# Altium schematic sheet Main.SchDoc
size A1; SheetNumber: 1; SheetTotal: 1
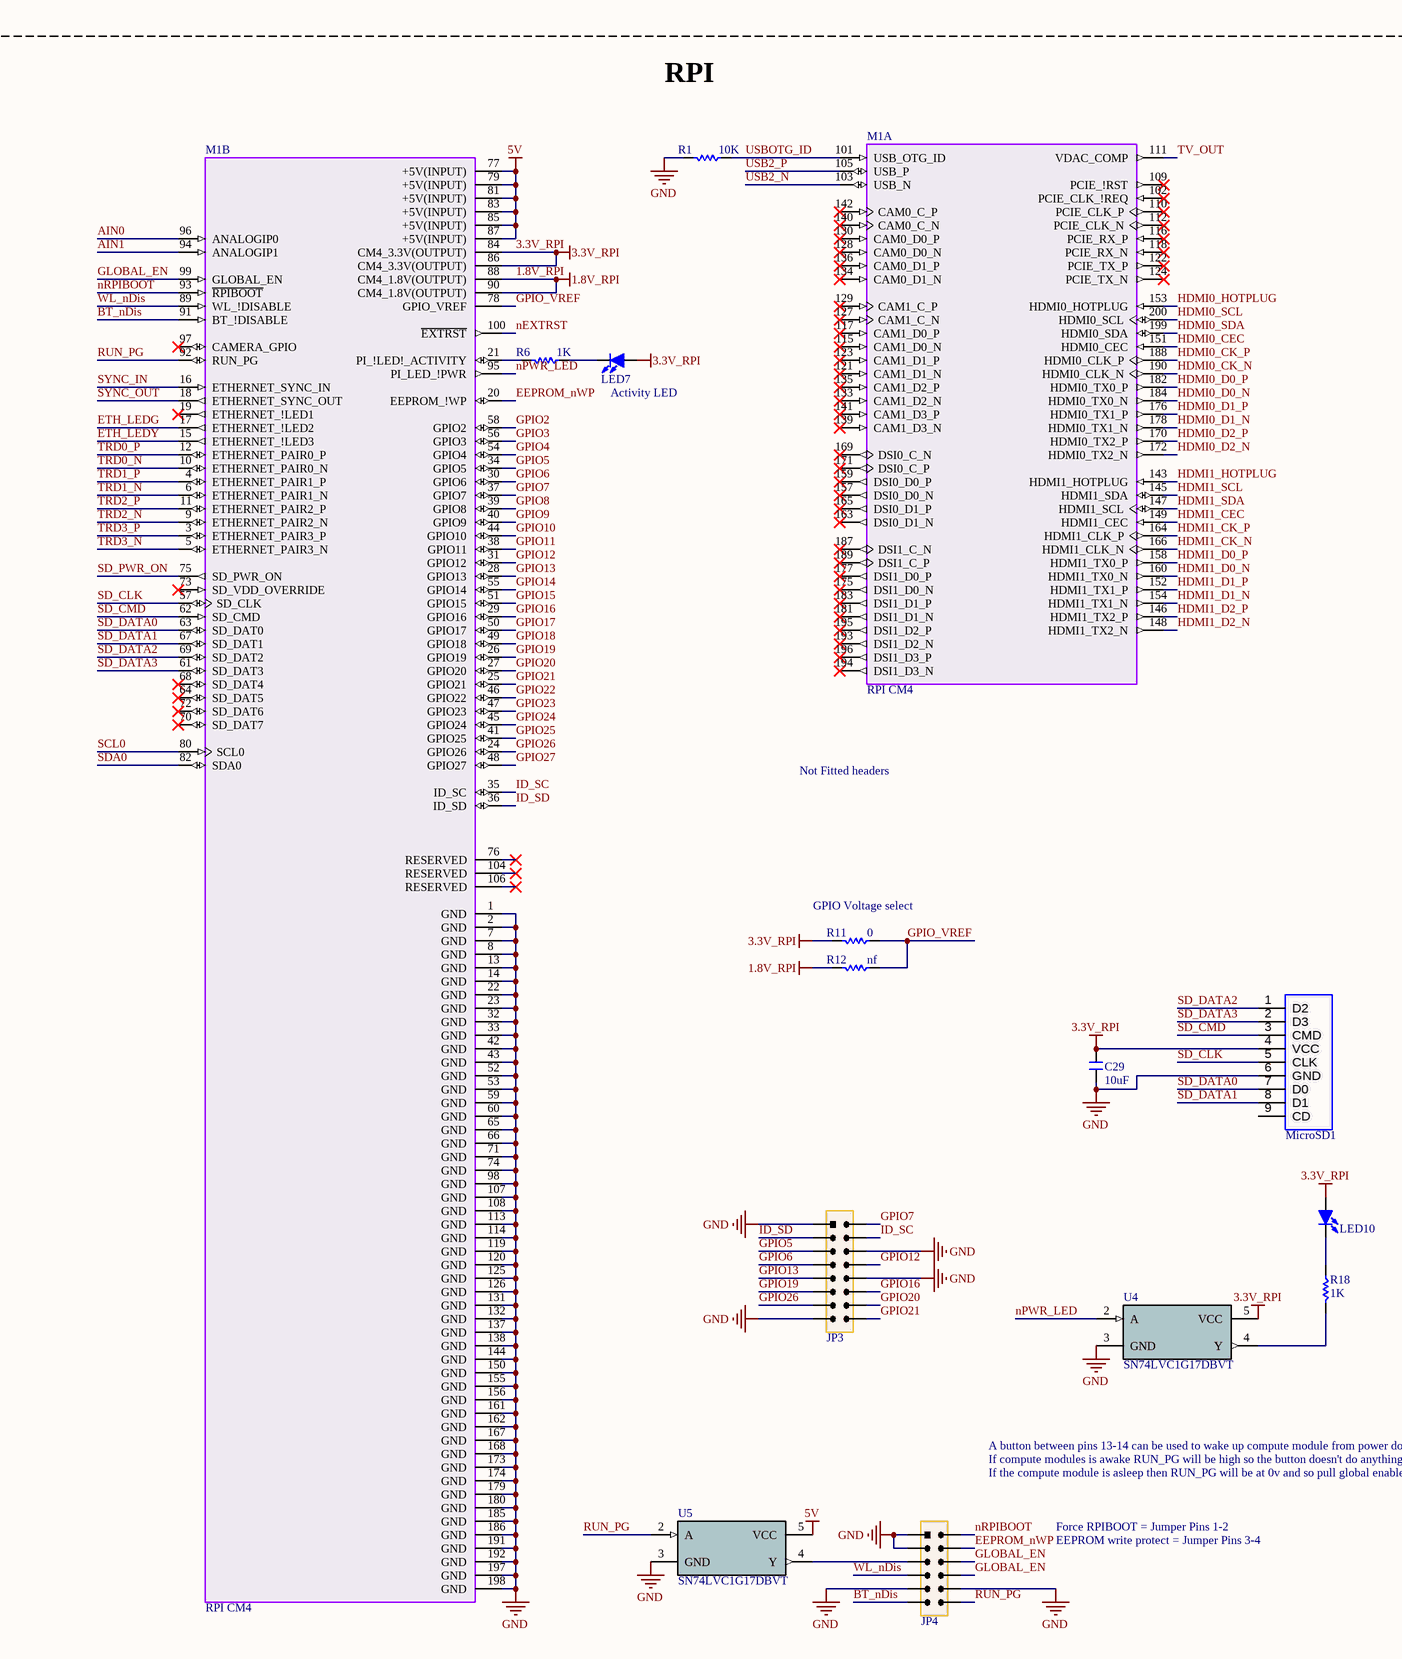
[diagram p0: Main.SchDoc, top left]
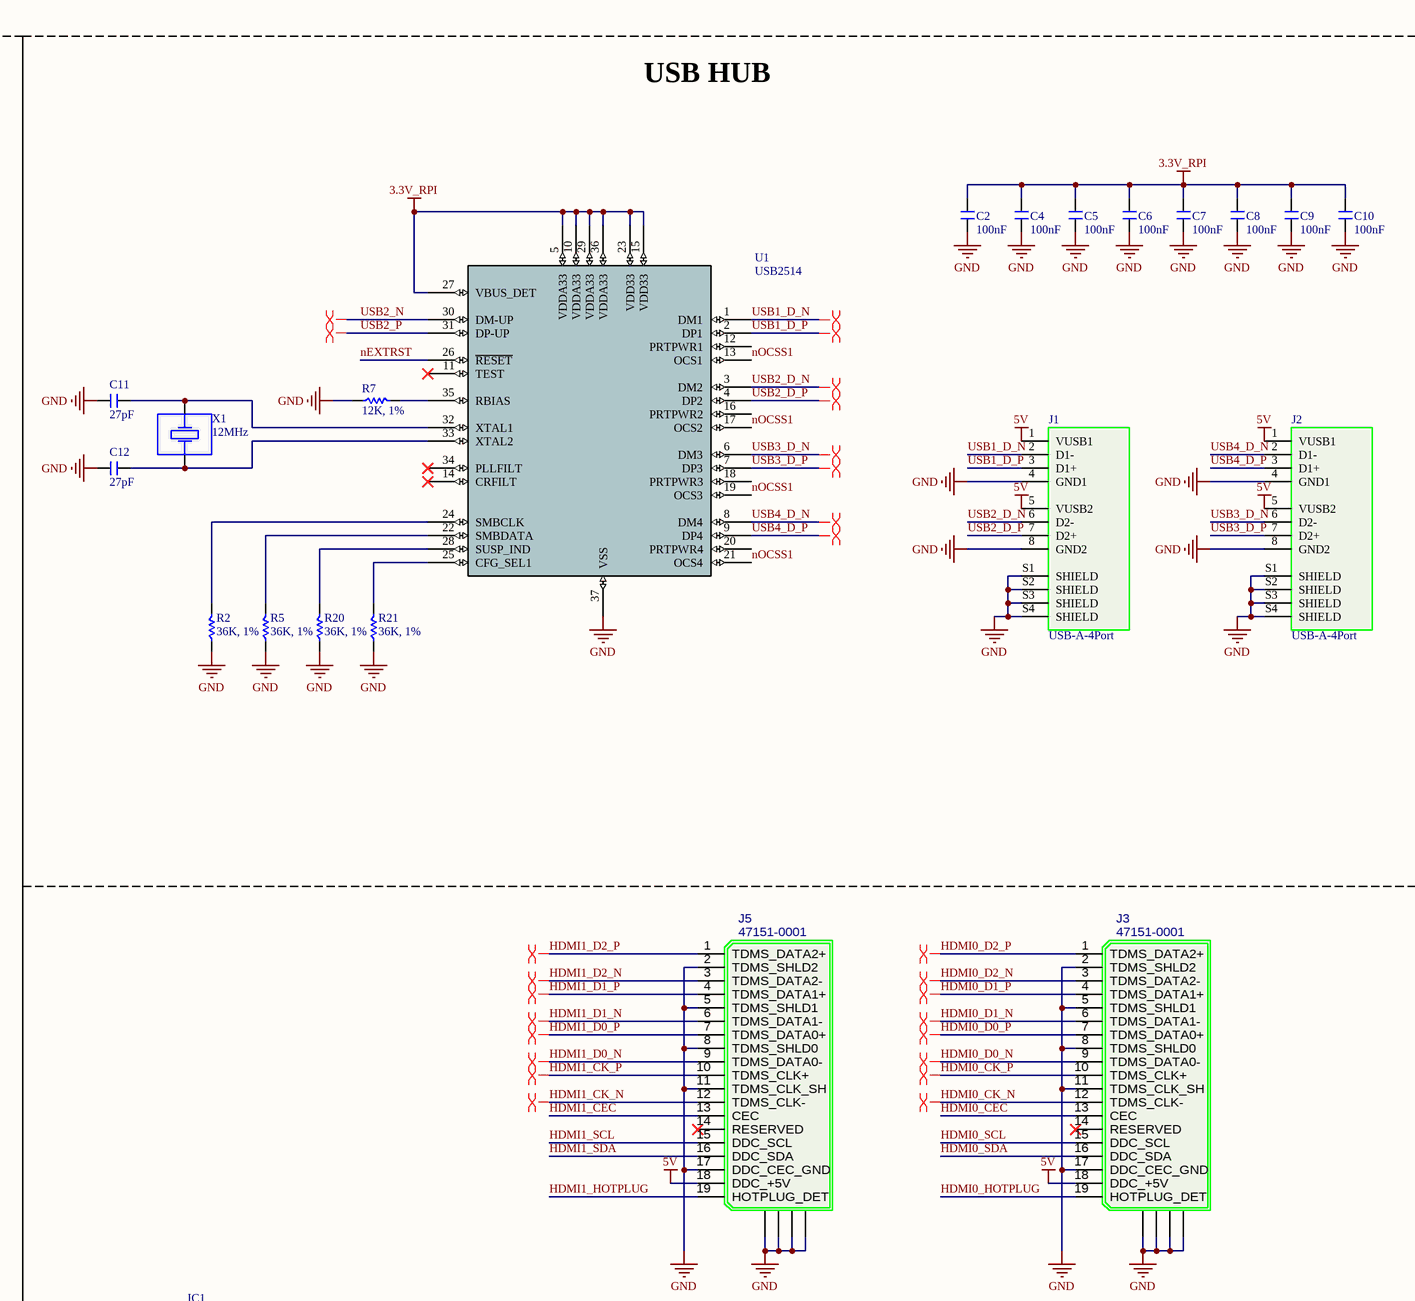
[diagram p1: Main.SchDoc, top middle]
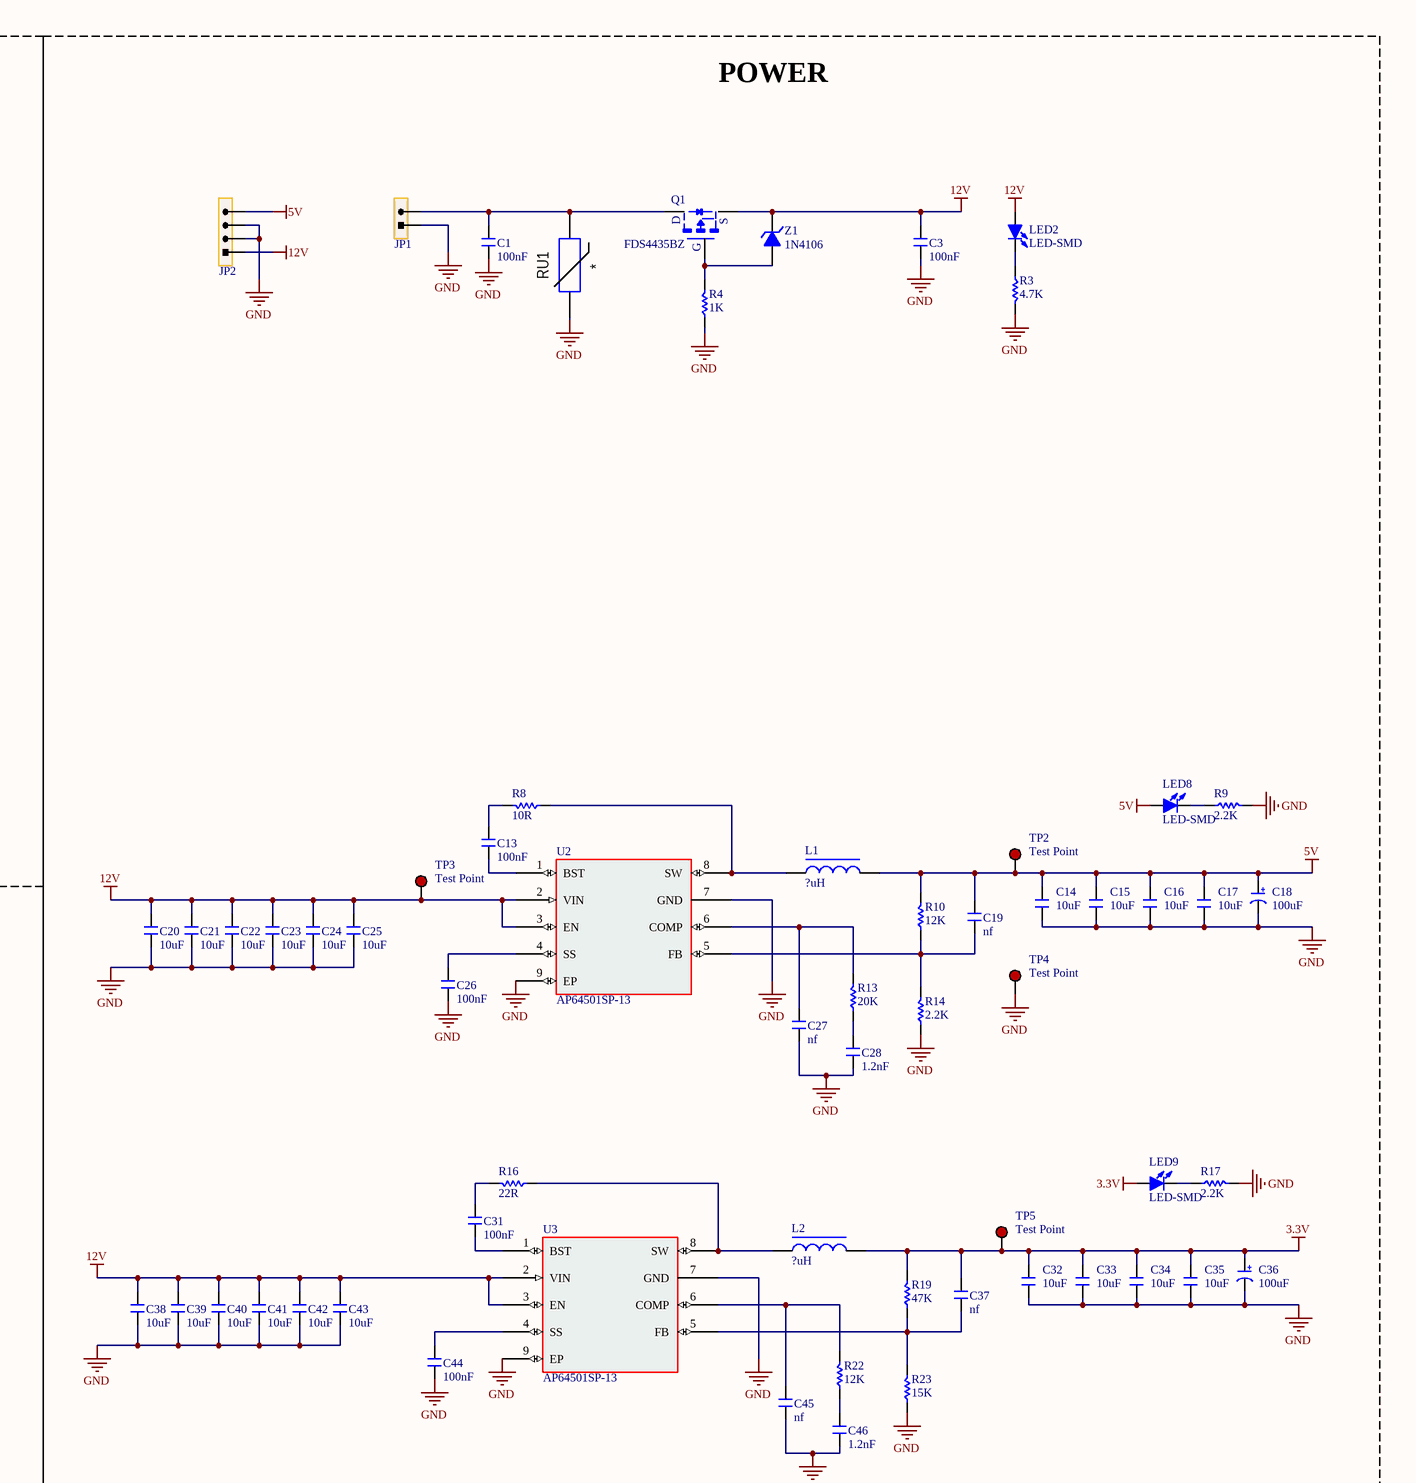
[diagram p2: Main.SchDoc, top right]
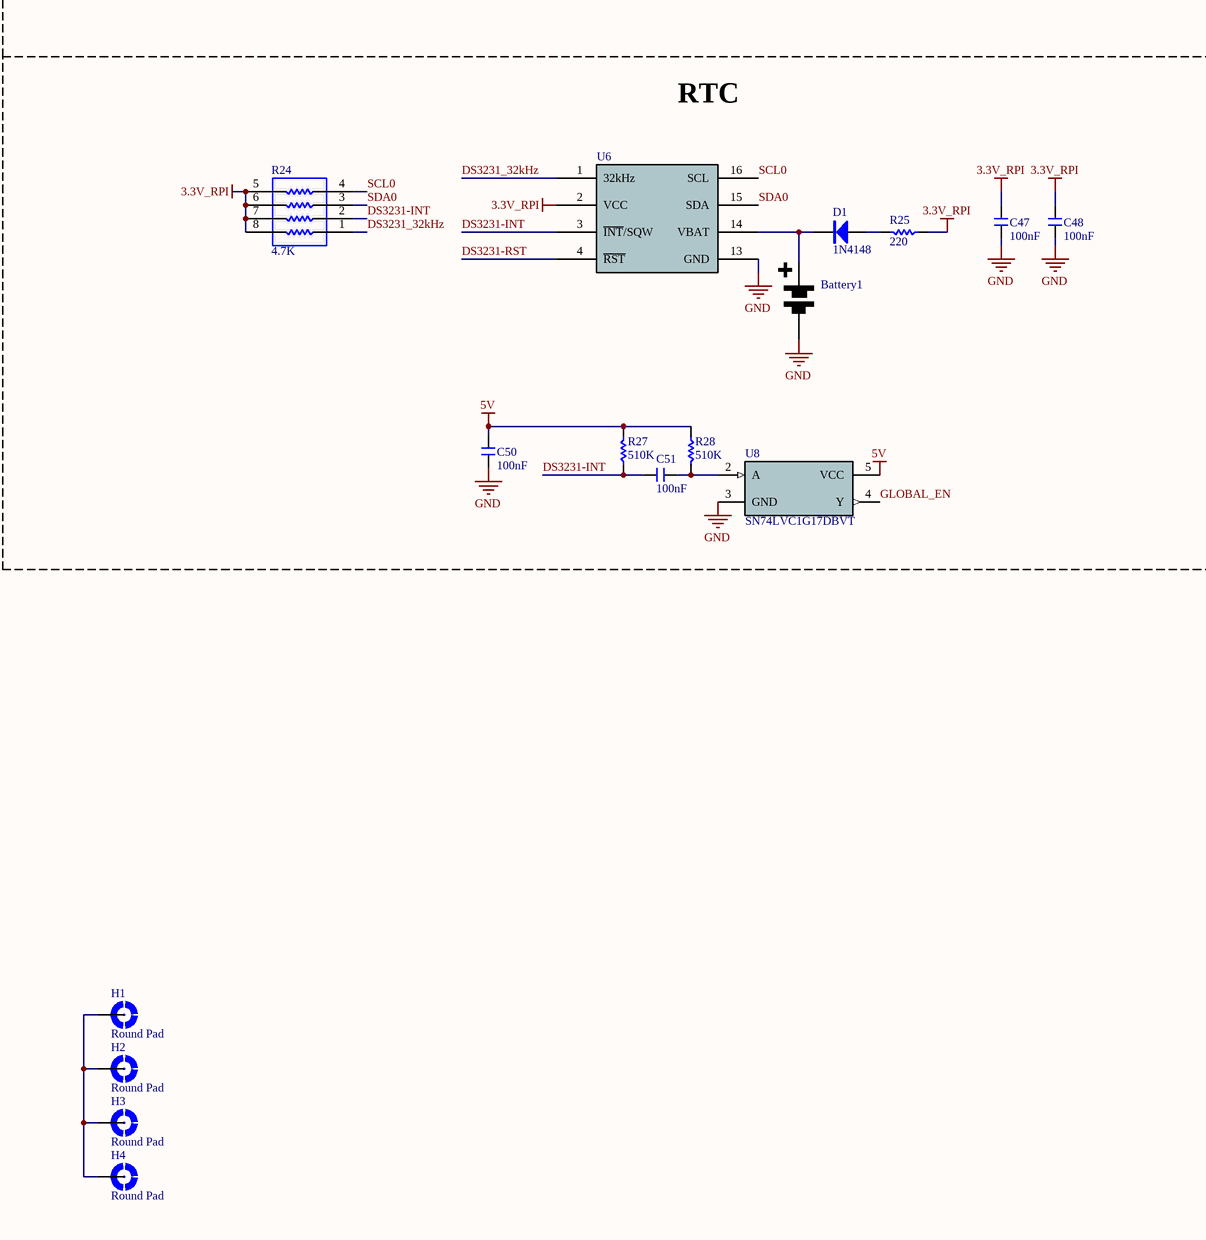
[diagram p3: Main.SchDoc, bottom left]
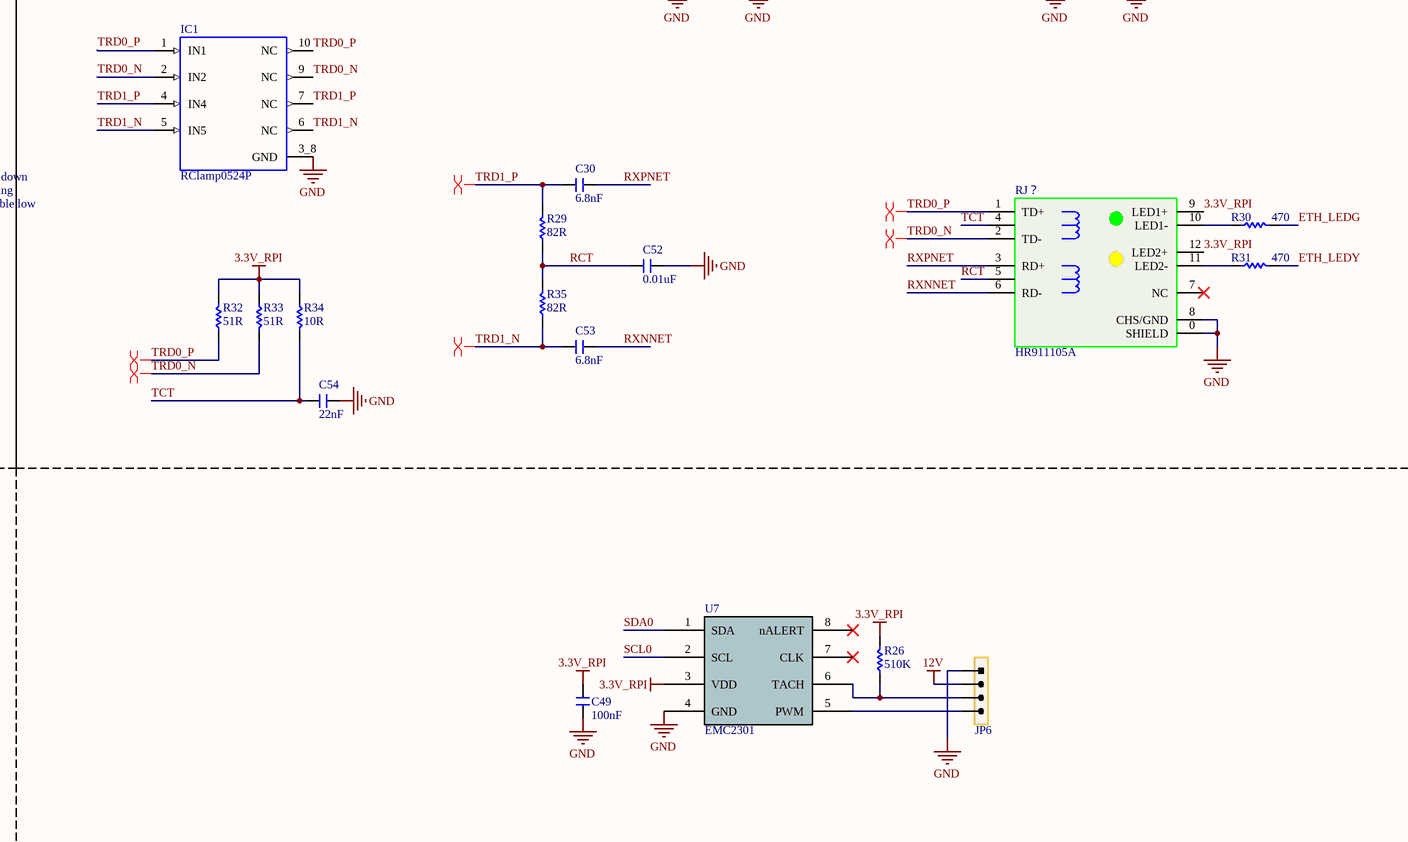
[diagram p4: Main.SchDoc, bottom middle]

## Parts
Battery1  Battery Button Cell  [CR2032]  (value not drawn)
C1  100nF  [C 0805]
C2  100nF  [C 0805]
C3  100nF  [C 0805]
C4  100nF  [C 0805]
C5  100nF  [C 0805]
C6  100nF  [C 0805]
C7  100nF  [C 0805]
C8  100nF  [C 0805]
C9  100nF  [C 0805]
C10  100nF  [C 0805]
C11  27pF  [C 0805]
C12  27pF  [C 0805]
C13  100nF  [C 0805]
C14  10uF  [C 0805]
C15  10uF  [C 0805]
C16  10uF  [C 0805]
C17  10uF  [C 0805]
C18  100uF  [CD D(7343)]
C19  nf  [C 0805]
C20  10uF  [C 0805]
C21  10uF  [C 0805]
C22  10uF  [C 0805]
C23  10uF  [C 0805]
C24  10uF  [C 0805]
C25  10uF  [C 0805]
C26  100nF  [C 0805]
C27  nf  [C 0805]
C28  1.2nF  [C 0805]
C29  10uF  [C 0805]
C30  6.8nF  [C 0805]
C31  100nF  [C 0805]
C32  10uF  [C 0805]
C33  10uF  [C 0805]
C34  10uF  [C 0805]
C35  10uF  [C 0805]
C36  100uF  [CD D(7343)]
C37  nf  [C 0805]
C38  10uF  [C 0805]
C39  10uF  [C 0805]
C40  10uF  [C 0805]
C41  10uF  [C 0805]
C42  10uF  [C 0805]
C43  10uF  [C 0805]
C44  100nF  [C 0805]
C45  nf  [C 0805]
C46  1.2nF  [C 0805]
C47  100nF  [C 0805]
C48  100nF  [C 0805]
C49  100nF  [C 0805]
C50  100nF  [C 0805]
C51  100nF  [C 0805]
C52  0.01uF  [C 0805]
C53  6.8nF  [C 0805]
C54  22nF  [C 0805]
D1  1N4148  [MINI_MELF (LL34)]
H1  Round Pad  [P3.2C]  (no BOM)
H2  Round Pad  [P3.2C]  (no BOM)
H3  Round Pad  [P3.2C]  (no BOM)
H4  Round Pad  [P3.2C]  (no BOM)
IC1  RClamp0524P  [RClamp0524P]
J1  USB-A-4Port  [USB-A-4Port]
J2  USB-A-4Port  [USB-A-4Port]
J3  47151-0001  [HDMI-A]
J5  47151-0001  [HDMI-A]
JP1  HDR-1X2  [KF2EDGK-2P_H_5.08]  (value not drawn)
JP2  HDR-1X4  [KF2EDGK-4P_H_5.08]  (value not drawn)
JP3  Header 8X2  [HDR-8X2]  (value not drawn)
JP4  Header 6X2  [HDR-6X2]  (value not drawn)
JP6  HDR-1X4  [KF2EDGK-4P_H_5.08]  (value not drawn)
L1  ?uH  [CD53]
L2  ?uH  [CD53]
LED2  LED-SMD  [LED 0805R]
LED7  LED GREEN  [LED 0805R]  (value not drawn)
LED8  LED-SMD  [LED 0805R]
LED9  LED-SMD  [LED 0805R]
LED10  LED RED  [LED 0805R]  (value not drawn)
M1  RPI CM4  [CM4]  (parts A,B of 2)
MicroSD1  MicroSD Card  [micro SD Card]  (value not drawn)
Q1  FDS4435BZ  [SOP8-E3]
R1  10K  [R 0805]
R2  36K, 1%  [R 0805]
R3  4.7K  [R 0805]
R4  1K  [R 0805]
R5  36K, 1%  [R 0805]
R6  1K  [R 0805]
R7  12K, 1%  [R 0805]
R8  10R  [R 0805]
R9  2.2K  [R 0805]
R10  12K  [R 0805]
R11  0  [R 0805]
R12  nf  [R 0805]
R13  20K  [R 0805]
R14  2.2K  [R 0805]
R16  22R  [R 0805]
R17  2.2K  [R 0805]
R18  1K  [R 0805]
R19  47K  [R 0805]
R20  36K, 1%  [R 0805]
R21  36K, 1%  [R 0805]
R22  12K  [R 0805]
R23  15K  [R 0805]
R24  4.7K  [RA1206 (4x0603)]
R25  220  [R 0805]
R26  510K  [R 0805]
R27  510K  [R 0805]
R28  510K  [R 0805]
R29  82R  [R 0805]
R30  470  [R 0805]
R31  470  [R 0805]
R32  51R  [R 0805]
R33  51R  [R 0805]
R34  10R  [R 0805]
R35  82R  [R 0805]
RJ？  HR911105A  [RJ-45A12]
RU1  *  [SMA]
TP2  Test Point  [TEST_POINT_40MIL_R]
TP3  Test Point  [TEST_POINT_40MIL_R]
TP4  Test Point  [TEST_POINT_40MIL_R]
TP5  Test Point  [TEST_POINT_40MIL_R]
U1  USB2514  [QFN36]
U2  AP64501SP-13  [SOP8_M-EP]
U3  AP64501SP-13  [SOP8_M-EP]
U4  SN74LVC1G17DBVT  [SOT23-5M]
U5  SN74LVC1G17DBVT  [SOT23-5M]
U6  DS3231  [SOP16W_L]  (value not drawn)
U7  EMC2301  [MSOP-8]
U8  SN74LVC1G17DBVT  [SOT23-5M]
X1  12MHz  [XTAL-HC49S-SMD]
Z1  1N4106  [DO-213AA]

## Nets
1.8V_RPI: M1.88(CM4_1.8V(OUTPUT)) M1.90(CM4_1.8V(OUTPUT)) R12.2
3.3V: C32.1 C33.1 C34.1 C35.1 C36.1(A) C37.1 L2.2 LED9.1(A) R19.2 TP5.1
3.3V_RPI: C2.1 C4.1 C5.1 C6.1 C7.1 C8.1 C9.1 C10.1 C29.1 C47.1 C48.2 C49.1 LED7.1(A) LED10.1(A) M1.84(CM4_3.3V(OUTPUT)) M1.86(CM4_3.3V(OUTPUT)) MicroSD1.4(VCC) R11.2 R24.5 R24.6 R24.7 R24.8 R25.1 R26.2 R32.2 R33.1 R34.1 RJ？.9(LED1+) RJ？.12(LED2+) U1.5(VDDA33) U1.10(VDDA33) U1.15(VDD33) U1.23(VDD33) U1.27(VBUS_DET) U1.29(VDDA33) U1.36(VDDA33) U4.5(VCC) U6.2(VCC) U7.3(VDD)
5V: C14.1 C15.1 C16.1 C17.1 C18.1(A) C19.1 C50.1 J1.1(VUSB1) J1.5(VUSB2) J2.1(VUSB1) J2.5(VUSB2) J3.18(DDC_+5V) J5.18(DDC_+5V) JP2.4 L1.2 LED8.1(A) M1.77(+5V(INPUT)) M1.79(+5V(INPUT)) M1.81(+5V(INPUT)) M1.83(+5V(INPUT)) M1.85(+5V(INPUT)) M1.87(+5V(INPUT)) R10.2 R27.2 R28.1 TP2.1 U5.5(VCC) U8.5(VCC)
12V: C3.1 C20.1 C21.1 C22.1 C23.1 C24.1 C25.1 C38.1 C39.1 C40.1 C41.1 C42.1 C43.1 JP2.1 JP6.2 LED2.1(A) Q1.1-3(S) TP3.1 U2.2(VIN) U2.3(EN) U3.2(VIN) U3.3(EN) Z1.2(K)
GND: Battery1.2(-) C1.2 C2.2 C3.2 C4.2 C5.2 C6.2 C7.2 C8.2 C9.2 C10.2 C11.2 C12.2 C14.2 C15.2 C16.2 C17.2 C18.2(K) C20.2 C21.2 C22.2 C23.2 C24.2 C25.2 C26.2 C27.2 C28.2 C29.2 C32.2 C33.2 C34.2 C35.2 C36.2(K) C38.2 C39.2 C40.2 C41.2 C42.2 C43.2 C44.2 C45.2 C46.2 C47.2 C48.1 C49.2 C50.2 C52.2 C54.2 IC1.3_8(GND) J1.4(GND1) J1.8(GND2) J1.S1(SHIELD) J1.S2(SHIELD) J1.S3(SHIELD) J1.S4(SHIELD) J2.4(GND1) J2.8(GND2) J2.S1(SHIELD) J2.S2(SHIELD) J2.S3(SHIELD) J2.S4(SHIELD) J3.2(TDMS_SHLD2) J3.5(TDMS_SHLD1) J3.8(TDMS_SHLD0) J3.11(TDMS_CLK_SH) J3.17(DDC_CEC_GND) J3.20(SHIELD) J3.21(SHIELD) J3.22(SHIELD) J3.23(SHIELD) J5.2(TDMS_SHLD2) J5.5(TDMS_SHLD1) J5.8(TDMS_SHLD0) J5.11(TDMS_CLK_SH) J5.17(DDC_CEC_GND) J5.20(SHIELD) J5.21(SHIELD) J5.22(SHIELD) J5.23(SHIELD) JP1.1 JP2.2 JP2.3 JP3.1 JP3.6 JP3.10 JP3.15 JP4.1 JP4.3 JP4.9 JP4.10 JP6.1 M1.1(GND) M1.2(GND) M1.7(GND) M1.8(GND) M1.13(GND) M1.14(GND) M1.22(GND) M1.23(GND) M1.32(GND) M1.33(GND) M1.42(GND) M1.43(GND) M1.52(GND) M1.53(GND) M1.59(GND) M1.60(GND) M1.65(GND) M1.66(GND) M1.71(GND) M1.74(GND) M1.98(GND) M1.107(GND) M1.108(GND) M1.113(GND) M1.114(GND) M1.119(GND) M1.120(GND) M1.125(GND) M1.126(GND) M1.131(GND) M1.132(GND) M1.137(GND) M1.138(GND) M1.144(GND) M1.150(GND) M1.155(GND) M1.156(GND) M1.161(GND) M1.162(GND) M1.167(GND) M1.168(GND) M1.173(GND) M1.174(GND) M1.179(GND) M1.180(GND) M1.185(GND) M1.186(GND) M1.191(GND) M1.192(GND) M1.197(GND) M1.198(GND) MicroSD1.6(GND) R1.2 R2.1 R3.2 R4.1 R5.1 R7.1 R9.2 R14.1 R17.2 R20.1 R21.1 R23.1 RJ？.0(SHIELD) RJ？.8(CHS/GND) RU1.1 TP4.1 U1.37(VSS) U2.7(GND) U2.9(EP) U3.7(GND) U3.9(EP) U4.3(GND) U5.3(GND) U6.13(GND) U7.4(GND) U8.3(GND)
SHIELD: H1.P H2.P H3.P H4.P
AIN0: M1.96(ANALOGIP0)
AIN1: M1.94(ANALOGIP1)
BT_nDis: JP4.11 M1.91(BT_!DISABLE)
DS3231-INT: C51.2 R24.2 R27.1 U6.3(~{INT}/SQW)
DS3231-RST: U6.4(~{RST})
DS3231_32kHz: R24.1 U6.1(32kHz)
EEPROM_nWP: JP4.4 M1.20(EEPROM_!WP)
ETH_LEDG: M1.17(ETHERNET_!LED2) R30.2
ETH_LEDY: M1.15(ETHERNET_!LED3) R31.2
GLOBAL_EN: JP4.6 JP4.8 M1.99(GLOBAL_EN) U8.4(Y)
GPIO2: M1.58(GPIO2)
GPIO3: M1.56(GPIO3)
GPIO4: M1.54(GPIO4)
GPIO5: JP3.5 M1.34(GPIO5)
GPIO6: JP3.7 M1.30(GPIO6)
GPIO7: JP3.2 M1.37(GPIO7)
GPIO8: M1.39(GPIO8)
GPIO9: M1.40(GPIO9)
GPIO10: M1.44(GPIO10)
GPIO11: M1.38(GPIO11)
GPIO12: JP3.8 M1.31(GPIO12)
GPIO13: JP3.9 M1.28(GPIO13)
GPIO14: M1.55(GPIO14)
GPIO15: M1.51(GPIO15)
GPIO16: JP3.12 M1.29(GPIO16)
GPIO17: M1.50(GPIO17)
GPIO18: M1.49(GPIO18)
GPIO19: JP3.11 M1.26(GPIO19)
GPIO20: JP3.14 M1.27(GPIO20)
GPIO21: JP3.16 M1.25(GPIO21)
GPIO22: M1.46(GPIO22)
GPIO23: M1.47(GPIO23)
GPIO24: M1.45(GPIO24)
GPIO25: M1.41(GPIO25)
GPIO26: JP3.13 M1.24(GPIO26)
GPIO27: M1.48(GPIO27)
GPIO_VREF: M1.78(GPIO_VREF) R11.1 R12.1
HDMI0_CEC: J3.13(CEC) M1.151(HDMI0_CEC)
HDMI0_CK_N: J3.12(TDMS_CLK-) M1.190(HDMI0_CLK_N)
HDMI0_CK_P: J3.10(TDMS_CLK+) M1.188(HDMI0_CLK_P)
HDMI0_D0_N: J3.9(TDMS_DATA0-) M1.184(HDMI0_TX0_N)
HDMI0_D0_P: J3.7(TDMS_DATA0+) M1.182(HDMI0_TX0_P)
HDMI0_D1_N: J3.6(TDMS_DATA1-) M1.178(HDMI0_TX1_N)
HDMI0_D1_P: J3.4(TDMS_DATA1+) M1.176(HDMI0_TX1_P)
HDMI0_D2_N: J3.3(TDMS_DATA2-) M1.172(HDMI0_TX2_N)
HDMI0_D2_P: J3.1(TDMS_DATA2+) M1.170(HDMI0_TX2_P)
HDMI0_HOTPLUG: J3.19(HOTPLUG_DET) M1.153(HDMI0_HOTPLUG)
HDMI0_SCL: J3.15(DDC_SCL) M1.200(HDMI0_SCL)
HDMI0_SDA: J3.16(DDC_SDA) M1.199(HDMI0_SDA)
HDMI1_CEC: J5.13(CEC) M1.149(HDMI1_CEC)
HDMI1_CK_N: J5.12(TDMS_CLK-) M1.166(HDMI1_CLK_N)
HDMI1_CK_P: J5.10(TDMS_CLK+) M1.164(HDMI1_CLK_P)
HDMI1_D0_N: J5.9(TDMS_DATA0-) M1.160(HDMI1_TX0_N)
HDMI1_D0_P: J5.7(TDMS_DATA0+) M1.158(HDMI1_TX0_P)
HDMI1_D1_N: J5.6(TDMS_DATA1-) M1.154(HDMI1_TX1_N)
HDMI1_D1_P: J5.4(TDMS_DATA1+) M1.152(HDMI1_TX1_P)
HDMI1_D2_N: J5.3(TDMS_DATA2-) M1.148(HDMI1_TX2_N)
HDMI1_D2_P: J5.1(TDMS_DATA2+) M1.146(HDMI1_TX2_P)
HDMI1_HOTPLUG: J5.19(HOTPLUG_DET) M1.143(HDMI1_HOTPLUG)
HDMI1_SCL: J5.15(DDC_SCL) M1.145(HDMI1_SDA)
HDMI1_SDA: J5.16(DDC_SDA) M1.147(HDMI1_SCL)
ID_SC: JP3.4 M1.35(ID_SC)
ID_SD: JP3.3 M1.36(ID_SD)
nEXTRST: M1.100(~{EXTRST}) U1.26(~{RESET})
nOCSS1: U1.13(OCS1) U1.17(OCS2) U1.19(OCS3) U1.21(OCS4)
nPWR_LED: M1.95(PI_LED_!PWR) U4.2(A)
nRPIBOOT: JP4.2 M1.93(~{RPIBOOT})
RCT: C52.1 R29.1 R35.2 RJ？.5
RUN_PG: JP4.12 M1.92(RUN_PG) U5.2(A)
RXNNET: C53.2 RJ？.6(RD-)
RXPNET: C30.2 RJ？.3(RD+)
SCL0: M1.80(SCL0) R24.4 U6.16(SCL) U7.2(SCL)
SD_CLK: M1.57(SD_CLK) MicroSD1.5(CLK)
SD_CMD: M1.62(SD_CMD) MicroSD1.3(CMD)
SD_DATA0: M1.63(SD_DAT0) MicroSD1.7(D0)
SD_DATA1: M1.67(SD_DAT1) MicroSD1.8(D1)
SD_DATA2: M1.69(SD_DAT2) MicroSD1.1(D2)
SD_DATA3: M1.61(SD_DAT3) MicroSD1.2(D3)
SD_PWR_ON: M1.75(SD_PWR_ON)
SDA0: M1.82(SDA0) R24.3 U6.15(SDA) U7.1(SDA)
SYNC_IN: M1.16(ETHERNET_SYNC_IN)
SYNC_OUT: M1.18(ETHERNET_SYNC_OUT)
TCT: C54.1 R34.2 RJ？.4
TRD0_N: IC1.2(IN2) IC1.9(NC) M1.10(ETHERNET_PAIR0_N) R33.2 RJ？.2(TD-)
TRD0_P: IC1.1(IN1) IC1.10(NC) M1.12(ETHERNET_PAIR0_P) R32.1 RJ？.1(TD+)
TRD1_N: C53.1 IC1.5(IN5) IC1.6(NC) M1.6(ETHERNET_PAIR1_N) R35.1
TRD1_P: C30.1 IC1.4(IN4) IC1.7(NC) M1.4(ETHERNET_PAIR1_P) R29.2
TRD2_N: M1.9(ETHERNET_PAIR2_N)
TRD2_P: M1.11(ETHERNET_PAIR2_P)
TRD3_N: M1.5(ETHERNET_PAIR3_N)
TRD3_P: M1.3(ETHERNET_PAIR3_P)
TV_OUT: M1.111(VDAC_COMP)
USB1_D_N: J1.2(D1-) U1.1(DM1)
USB1_D_P: J1.3(D1+) U1.2(DP1)
USB2_D_N: J1.6(D2-) U1.3(DM2)
USB2_D_P: J1.7(D2+) U1.4(DP2)
USB2_N: M1.103(USB_N) U1.30(DM-UP)
USB2_P: M1.105(USB_P) U1.31(DP-UP)
USB3_D_N: J2.6(D2-) U1.6(DM3)
USB3_D_P: J2.7(D2+) U1.7(DP3)
USB4_D_N: J2.2(D1-) U1.8(DM4)
USB4_D_P: J2.3(D1+) U1.9(DP4)
USBOTG_ID: M1.101(USB_OTG_ID) R1.1
WL_nDis: JP4.7 M1.89(WL_!DISABLE)
NetBattery1_1: Battery1.1(+) D1.2(K) U6.14(VBAT)
NetC1_1: C1.1 JP1.2 Q1.5-8(D) RU1.2
NetC11_1: C11.1 U1.32(XTAL1) X1.2
NetC12_1: C12.1 U1.33(XTAL2) X1.1
NetC13_1: C13.1 U2.1(BST)
NetC13_2: C13.2 R8.2
NetC19_2: C19.2 R10.1 R14.2 U2.5(FB)
NetC26_1: C26.1 U2.4(SS)
NetC27_1: C27.1 R13.2 U2.6(COMP)
NetC28_1: C28.1 R13.1
NetC31_1: C31.1 U3.1(BST)
NetC31_2: C31.2 R16.2
NetC37_2: C37.2 R19.1 R23.2 U3.5(FB)
NetC44_1: C44.1 U3.4(SS)
NetC45_1: C45.1 R22.2 U3.6(COMP)
NetC46_1: C46.1 R22.1
NetC51_1: C51.1 R28.2 U8.2(A)
NetD1_1: D1.1(A) R25.2
NetH1_P: H1.P H2.P H3.P H4.P
NetJP4_5: JP4.5 U5.4(Y)
NetJP6_3: JP6.3 R26.1 U7.6(TACH)
NetJP6_4: JP6.4 U7.5(PWM)
NetL1_1: L1.1 R8.1 U2.8(SW)
NetL2_1: L2.1 R16.1 U3.8(SW)
NetLED2_2: LED2.2(K) R3.1
NetLED7_2: LED7.2(K) R6.1
NetLED8_2: LED8.2(K) R9.1
NetLED9_2: LED9.2(K) R17.1
NetLED10_2: LED10.2(K) R18.1
NetM1_21: M1.21(PI_!LED!_ACTIVITY) R6.2
NetQ1_4: Q1.4(G) R4.2 Z1.1(A)
NetR2_2: R2.2 U1.24(SMBCLK)
NetR5_2: R5.2 U1.22(SMBDATA)
NetR7_2: R7.2 U1.35(RBIAS)
NetR18_2: R18.2 U4.4(Y)
NetR20_2: R20.2 U1.28(SUSP_IND)
NetR21_2: R21.2 U1.25(CFG_SEL1)
NetR30_1: R30.1 RJ？.10(LED1-)
NetR31_1: R31.1 RJ？.11(LED2-)

Not connected (* = marked no-connect by the designer): J3 14(RESERVED)*; J5 14(RESERVED)*; M1 19(ETHERNET_!LED1)* 64(SD_DAT5)* 68(SD_DAT4)* 70(SD_DAT7)* 72(SD_DAT6)* 73(SD_VDD_OVERRIDE)* 76(RESERVED)* 97(CAMERA_GPIO)* 102(PCIE_CLK_!REQ)* 104(RESERVED)* 106(RESERVED)* 109(PCIE_!RST)* 110(PCIE_CLK_P)* 112(PCIE_CLK_N)* 115(CAM1_D0_N)* 116(PCIE_RX_P)* 117(CAM1_D0_P)* 118(PCIE_RX_N)* 121(CAM1_D1_N)* 122(PCIE_TX_P)* 123(CAM1_D1_P)* 124(PCIE_TX_N)* 127(CAM1_C_N)* 128(CAM0_D0_N)* 129(CAM1_C_P)* 130(CAM0_D0_P)* 133(CAM1_D2_N)* 134(CAM0_D1_N)* 135(CAM1_D2_P)* 136(CAM0_D1_P)* 139(CAM1_D3_N)* 140(CAM0_C_N)* 141(CAM1_D3_P)* 142(CAM0_C_P)* 157(DSI0_D0_N)* 159(DSI0_D0_P)* 163(DSI0_D1_N)* 165(DSI0_D1_P)* 169(DSI0_C_N)* 171(DSI0_C_P)* 175(DSI1_D0_N)* 177(DSI1_D0_P)* 181(DSI1_D1_N)* 183(DSI1_D1_P)* 187(DSI1_C_N)* 189(DSI1_C_P)* 193(DSI1_D2_N)* 194(DSI1_D3_N)* 195(DSI1_D2_P)* 196(DSI1_D3_P)*; MicroSD1 9(CD); RJ？ 7(NC)*; U1 11(TEST)* 12(PRTPWR1) 14(CRFILT)* 16(PRTPWR2) 18(PRTPWR3) 20(PRTPWR4) 34(PLLFILT)*; U7 7(CLK)* 8(nALERT)*

## Layout directives
differential pair: HDMI0_CK_N, HDMI0_CK_P, HDMI0_D0_N, HDMI0_D0_P, HDMI0_D1_N, HDMI0_D1_P, HDMI0_D2_N, HDMI0_D2_P, HDMI1_CK_N, HDMI1_CK_P, HDMI1_D0_N, HDMI1_D0_P, HDMI1_D1_N, HDMI1_D1_P, HDMI1_D2_N, HDMI1_D2_P, TRD0_N, TRD0_P, TRD1_N, TRD1_P, USB1_D_N, USB1_D_P, USB2_D_N, USB2_D_P, USB2_N, USB2_P, USB3_D_N, USB3_D_P, USB4_D_N, USB4_D_P

## Notes on the sheet
- RPI
- USB HUB
- POWER
- (near LED7) Activity LED
- Not Fitted headers
- (near R11) GPIO Voltage select
- A button between pins 13-14 can be used to wake up compute module from power down
- If compute modules is awake RUN_PG will be high so the button doesn't do anything
- If the compute module is asleep then RUN_PG will be at 0v and so pull global enable low
- Force RPIBOOT = Jumper Pins 1-2
- EEPROM write protect = Jumper Pins 3-4
- RTC
- (in symbol C-CD) +

## Library data of the parts
Battery1 = Battery Button Cell: Mini Battery
C1-C17 C19-C35 C37-C54 = C: Non-polar patch capacitor; BOM名称: 无极性贴片电容; 版权归属: 源创客; 学习资源: www.ooocke.com
C18 C36 = C-CD: Solid Tantalum Chip Capacitor, Standard T491 Series - Industrial Grade; Published: 17-Jul-2002; LatestRevisionDate: 19-Mar-2004; LatestRevisionNote: Silkscreen dimensions re-sized.; DatasheetDocument: Mar-2001; PackageDocument: Mar-2001; PackageReference: B; Publisher: Altium Limited; Code_JEITA: 3528-21; ComponentLink1Description: Manufacturer Link; ComponentLink1URL: http://www.kemet.com/; ComponentLink2Description: Datasheet; ComponentLink2URL: http://www.kemet.com/kemet/web/homepage/kechome.nsf/vapubfilesname/F3102TA.pdf/$file/F3102TA.pdf
D1 = 1N4148: High speed switching diode; BOM名称: 高速开关二极管; 版权归属: 源创客; 学习资源: www.ooocke.com
H1-H4 = MOUNT-PAD-ROUND: MOUNTING PAD, round
J3 J5 = HDMI-A: CONNECTOR, HDMI TYPE A, R/A, SMD; Manufacturer: MOLEX; Part Number: 47151-0001
JP1 = Header 2: 2P Connector; BOM名称: 2P接插件; 版权归属: 源创客; 学习资源: www.ooocke.com
JP2 JP6 = Header 4: 4P Connector; BOM名称: 4P接插件; 版权归属: 源创客; 学习资源: www.ooocke.com
JP3 = Header 8X2: 8*2P Connector; BOM名称: 8*2P接插件; 版权归属: 源创客; 学习资源: www.ooocke.com
JP4 = Header  6X2: 6*2P Connector; BOM名称: 6*2P接插件; 版权归属: 源创客; 学习资源: www.ooocke.com
L1 L2 = L-CD: Chip power inductor; BOM名称: 功率电感; 版权归属: 源创客; 学习资源: www.ooocke.com
LED2 LED7-LED10 = LED-SMD: Patch LED; BOM名称: 贴片LED; 版权归属: 源创客; 学习资源: www.ooocke.com
M1 = CM4
MicroSD1 = MicroSD Card: MicroSD
R1-R14 R16-R23 R25-R35 = R: Chip resistor; 版权归属: 源创客; BOM名称: Chip resistor; 学习资源: www.ooocke.com
R24 = R-ARR: 4 way Chip Resistor Array
RJ？ = HR911105A: Illuminated Ethernet interface; BOM名称: 带灯以太网接口; 版权归属: 源创客; 学习资源: www.ooocke.com
RU1 = V: Versiror; Manufacturer: *; Model: *; HelpURL: *; ComponentKind: *; Value: *
U4 U5 U8 = SN74LVC1G17DBVT: Single 1.65-V to 5.5-V buffer with Schmitt-Trigger inputs
U6 = DS3231: Real time clock chip
U7 = EMC2301: PWM Fan Controller
X1 = XTAL-2: 2-Pin crystal; BOM名称: 2脚晶振; 版权归属: 源创客; 学习资源: www.ooocke.com
Z1 = 1N4106: 12V/0.5W voltage regulator; BOM名称: 12V/0.5W稳压管; 版权归属: 源创客; 学习资源: www.ooocke.com